# Altium schematic sheet Sheet1.SchDoc
size A3; SheetNumber: 1; SheetTotal: 1
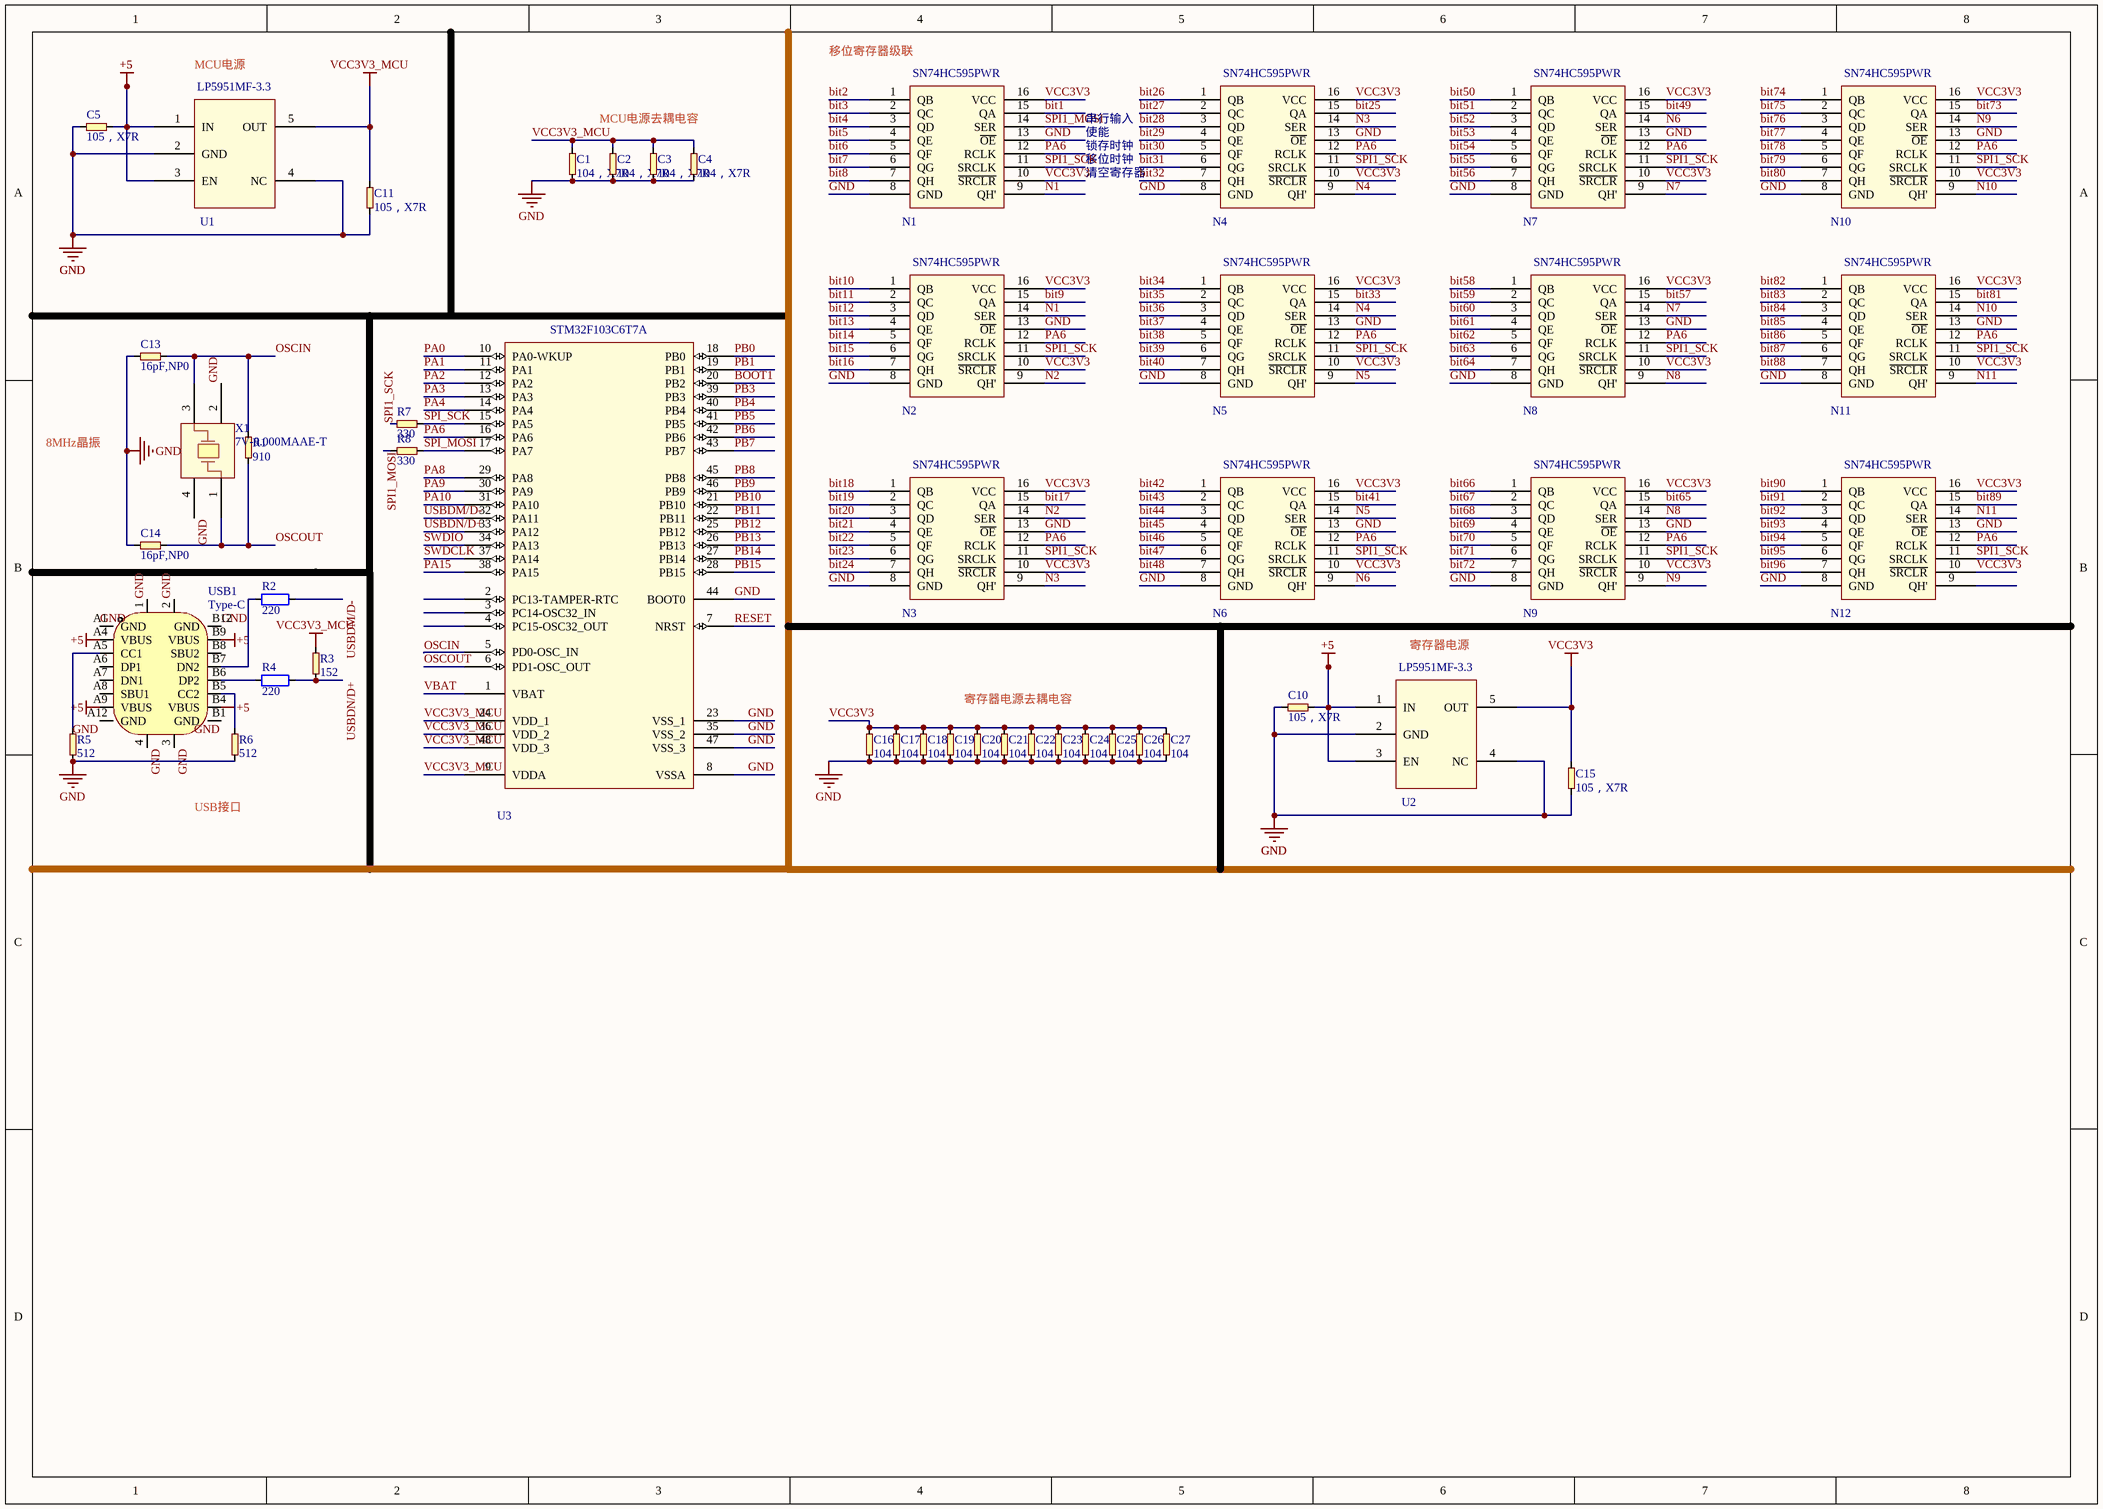
[diagram p0: Sheet1.SchDoc]

## Parts
C1  104，X7R  [0603]
C2  104，X7R  [0603]
C3  104，X7R  [0603]
C4  104，X7R  [0603]
C5  105，X7R  [0603]
C10  105，X7R  [0603]
C11  105，X7R  [0603]
C13  16pF,NP0  [0603]
C14  16pF,NP0  [0603]
C15  105，X7R  [0603]
C16  104  [0603]
C17  104  [0603]
C18  104  [0603]
C19  104  [0603]
C20  104  [0603]
C21  104  [0603]
C22  104  [0603]
C23  104  [0603]
C24  104  [0603]
C25  104  [0603]
C26  104  [0603]
C27  104  [0603]
N1  SN74HC595PWR  [TSSOP16-0r65-5r0x4r4-H1r2]
N2  SN74HC595PWR  [TSSOP16-0r65-5r0x4r4-H1r2]
N3  SN74HC595PWR  [TSSOP16-0r65-5r0x4r4-H1r2]
N4  SN74HC595PWR  [TSSOP16-0r65-5r0x4r4-H1r2]
N5  SN74HC595PWR  [TSSOP16-0r65-5r0x4r4-H1r2]
N6  SN74HC595PWR  [TSSOP16-0r65-5r0x4r4-H1r2]
N7  SN74HC595PWR  [TSSOP16-0r65-5r0x4r4-H1r2]
N8  SN74HC595PWR  [TSSOP16-0r65-5r0x4r4-H1r2]
N9  SN74HC595PWR  [TSSOP16-0r65-5r0x4r4-H1r2]
N10  SN74HC595PWR  [TSSOP16-0r65-5r0x4r4-H1r2]
N11  SN74HC595PWR  [TSSOP16-0r65-5r0x4r4-H1r2]
N12  SN74HC595PWR  [TSSOP16-0r65-5r0x4r4-H1r2]
R1  910  [0603]
R2  220  [RES_0402]
R3  152  [0603]
R4  220  [RES_0402]
R5  512  [0603]
R6  512  [0603]
R7  330  [0603]
R8  330  [0603]
U1  LP5951MF-3.3  [SOT23-5_2r90x1r60-H1r18-P0r95_G]
U2  LP5951MF-3.3  [SOT23-5_2r90x1r60-H1r18-P0r95_G]
U3  STM32F103C6T7A  [LQFP48-0r5-7x7-H1r6]
USB1  Type-C  [TYPE-C_16P]
X1  7V-8.000MAAE-T  [RESO3225-4_3r20x2r50-H0r90-P2r10]

## Nets
+5: C5.2 C10.2 U1.1(IN) U1.3(EN) U2.1(IN) U2.3(EN) USB1.A4(VBUS) USB1.A9(VBUS) USB1.B4(VBUS) USB1.B9(VBUS)
GND: C1.1 C2.1 C3.1 C4.1 C5.1 C10.1 C11.1 C13.1 C14.1 C15.1 C16.1 C17.1 C18.1 C19.1 C20.1 C21.1 C22.1 C23.1 C24.1 C25.1 C26.1 C27.1 N1.8(GND) N1.13(~{OE}) N2.8(GND) N2.13(~{OE}) N3.8(GND) N3.13(~{OE}) N4.8(GND) N4.13(~{OE}) N5.8(GND) N5.13(~{OE}) N6.8(GND) N6.13(~{OE}) N7.8(GND) N7.13(~{OE}) N8.8(GND) N8.13(~{OE}) N9.8(GND) N9.13(~{OE}) N10.8(GND) N10.13(~{OE}) N11.8(GND) N11.13(~{OE}) N12.8(GND) N12.13(~{OE}) R5.1 R6.1 U1.2(GND) U1.4(NC) U2.2(GND) U2.4(NC) U3.8(VSSA) U3.23(VSS_1) U3.35(VSS_2) U3.44(BOOT0) U3.47(VSS_3) USB1.1 USB1.2 USB1.3 USB1.4 USB1.A1(GND) USB1.A12(GND) USB1.B1(GND) USB1.B12(GND) X1.2(NC) X1.4(NC)
VCC3V3: C15.2 C16.2 C17.2 C18.2 C19.2 C20.2 C21.2 C22.2 C23.2 C24.2 C25.2 C26.2 C27.2 N1.10(~{SRCLR}) N1.16(VCC) N2.10(~{SRCLR}) N2.16(VCC) N3.10(~{SRCLR}) N3.16(VCC) N4.10(~{SRCLR}) N4.16(VCC) N5.10(~{SRCLR}) N5.16(VCC) N6.10(~{SRCLR}) N6.16(VCC) N7.10(~{SRCLR}) N7.16(VCC) N8.10(~{SRCLR}) N8.16(VCC) N9.10(~{SRCLR}) N9.16(VCC) N10.10(~{SRCLR}) N10.16(VCC) N11.10(~{SRCLR}) N11.16(VCC) N12.10(~{SRCLR}) N12.16(VCC) U2.5(OUT)
VCC3V3_MCU: C1.2 C2.2 C3.2 C4.2 C11.2 R3.2 U1.5(OUT) U3.9(VDDA) U3.24(VDD_1) U3.36(VDD_2) U3.48(VDD_3)
bit1: N1.15(QA)
bit2: N1.1(QB)
bit3: N1.2(QC)
bit4: N1.3(QD)
bit5: N1.4(QE)
bit6: N1.5(QF)
bit7: N1.6(QG)
bit8: N1.7(QH)
bit9: N2.15(QA)
bit10: N2.1(QB)
bit11: N2.2(QC)
bit12: N2.3(QD)
bit13: N2.4(QE)
bit14: N2.5(QF)
bit15: N2.6(QG)
bit16: N2.7(QH)
bit17: N3.15(QA)
bit18: N3.1(QB)
bit19: N3.2(QC)
bit20: N3.3(QD)
bit21: N3.4(QE)
bit22: N3.5(QF)
bit23: N3.6(QG)
bit24: N3.7(QH)
bit25: N4.15(QA)
bit26: N4.1(QB)
bit27: N4.2(QC)
bit28: N4.3(QD)
bit29: N4.4(QE)
bit30: N4.5(QF)
bit31: N4.6(QG)
bit32: N4.7(QH)
bit33: N5.15(QA)
bit34: N5.1(QB)
bit35: N5.2(QC)
bit36: N5.3(QD)
bit37: N5.4(QE)
bit38: N5.5(QF)
bit39: N5.6(QG)
bit40: N5.7(QH)
bit41: N6.15(QA)
bit42: N6.1(QB)
bit43: N6.2(QC)
bit44: N6.3(QD)
bit45: N6.4(QE)
bit46: N6.5(QF)
bit47: N6.6(QG)
bit48: N6.7(QH)
bit49: N7.15(QA)
bit50: N7.1(QB)
bit51: N7.2(QC)
bit52: N7.3(QD)
bit53: N7.4(QE)
bit54: N7.5(QF)
bit55: N7.6(QG)
bit56: N7.7(QH)
bit57: N8.15(QA)
bit58: N8.1(QB)
bit59: N8.2(QC)
bit60: N8.3(QD)
bit61: N8.4(QE)
bit62: N8.5(QF)
bit63: N8.6(QG)
bit64: N8.7(QH)
bit65: N9.15(QA)
bit66: N9.1(QB)
bit67: N9.2(QC)
bit68: N9.3(QD)
bit69: N9.4(QE)
bit70: N9.5(QF)
bit71: N9.6(QG)
bit72: N9.7(QH)
bit73: N10.15(QA)
bit74: N10.1(QB)
bit75: N10.2(QC)
bit76: N10.3(QD)
bit77: N10.4(QE)
bit78: N10.5(QF)
bit79: N10.6(QG)
bit80: N10.7(QH)
bit81: N11.15(QA)
bit82: N11.1(QB)
bit83: N11.2(QC)
bit84: N11.3(QD)
bit85: N11.4(QE)
bit86: N11.5(QF)
bit87: N11.6(QG)
bit88: N11.7(QH)
bit89: N12.15(QA)
bit90: N12.1(QB)
bit91: N12.2(QC)
bit92: N12.3(QD)
bit93: N12.4(QE)
bit94: N12.5(QF)
bit95: N12.6(QG)
bit96: N12.7(QH)
BOOT1: U3.20(PB2)
N1: N1.9(QH') N2.14(SER)
N2: N2.9(QH') N3.14(SER)
N3: N3.9(QH') N4.14(SER)
N4: N4.9(QH') N5.14(SER)
N5: N5.9(QH') N6.14(SER)
N6: N6.9(QH') N7.14(SER)
N7: N7.9(QH') N8.14(SER)
N8: N8.9(QH') N9.14(SER)
N9: N9.9(QH') N10.14(SER)
N10: N10.9(QH') N11.14(SER)
N11: N11.9(QH') N12.14(SER)
OSCIN: C13.2 R1.2 U3.5(PD0-OSC_IN) X1.3
OSCOUT: C14.2 R1.1 U3.6(PD1-OSC_OUT) X1.1
PA0: U3.10(PA0-WKUP)
PA1: U3.11(PA1)
PA2: U3.12(PA2)
PA3: U3.13(PA3)
PA4: U3.14(PA4)
PA6: N1.12(RCLK) N2.12(RCLK) N3.12(RCLK) N4.12(RCLK) N5.12(RCLK) N6.12(RCLK) N7.12(RCLK) N8.12(RCLK) N9.12(RCLK) N10.12(RCLK) N11.12(RCLK) N12.12(RCLK) U3.16(PA6)
PA8: U3.29(PA8)
PA9: U3.30(PA9)
PA10: U3.31(PA10)
PA15: U3.38(PA15)
PB0: U3.18(PB0)
PB1: U3.19(PB1)
PB3: U3.39(PB3)
PB4: U3.40(PB4)
PB5: U3.41(PB5)
PB6: U3.42(PB6)
PB7: U3.43(PB7)
PB8: U3.45(PB8)
PB9: U3.46(PB9)
PB10: U3.21(PB10)
PB11: U3.22(PB11)
PB12: U3.25(PB12)
PB13: U3.26(PB13)
PB14: U3.27(PB14)
PB15: U3.28(PB15)
RESET: U3.7(NRST)
SPI1_MOSI: N1.14(SER) R8.1
SPI1_SCK: N1.11(SRCLK) N2.11(SRCLK) N3.11(SRCLK) N4.11(SRCLK) N5.11(SRCLK) N6.11(SRCLK) N7.11(SRCLK) N8.11(SRCLK) N9.11(SRCLK) N10.11(SRCLK) N11.11(SRCLK) N12.11(SRCLK) R7.1
SPI_MOSI: R8.2 U3.17(PA7)
SPI_SCK: R7.2 U3.15(PA5)
SWDCLK: U3.37(PA14)
SWDIO: U3.34(PA13)
USBDM/D-: R2.2 U3.32(PA11)
USBDN/D+: R3.1 R4.2 U3.33(PA12)
VBAT: U3.1(VBAT)
NetR2_1: R2.1 USB1.B7(DN2)
NetR4_1: R4.1 USB1.B6(DP2)
NetR5_2: R5.2 USB1.A5(CC1)
NetR6_2: R6.2 USB1.B5(CC2)

Not connected (* = marked no-connect by the designer): N12 9(QH'); U3 2(PC13-TAMPER-RTC) 3(PC14-OSC32_IN) 4(PC15-OSC32_OUT); USB1 A6(DP1) A7(DN1) A8(SBU1) B8(SBU2)

## Notes on the sheet
- MCU电源
- 移位寄存器级联
- MCU电源去耦电容
- 串行输入
- 使能
- 锁存时钟
- 移位时钟
- 清空寄存器
- 8MHz晶振
- 寄存器电源
- 寄存器电源去耦电容
- USB接口

## Library data of the parts
C1-C5 C10 C11 C13-C27 = 0603电容
R1 R3 R5-R8 = 0603电阻
R2 R4 = Resistor_SMD: Value: 22R
USB1 = USB-Type-C: USB-Type-C_16P